# EAGLE schematic Arm-Claw Schematic (EAGLE 9.7.0)
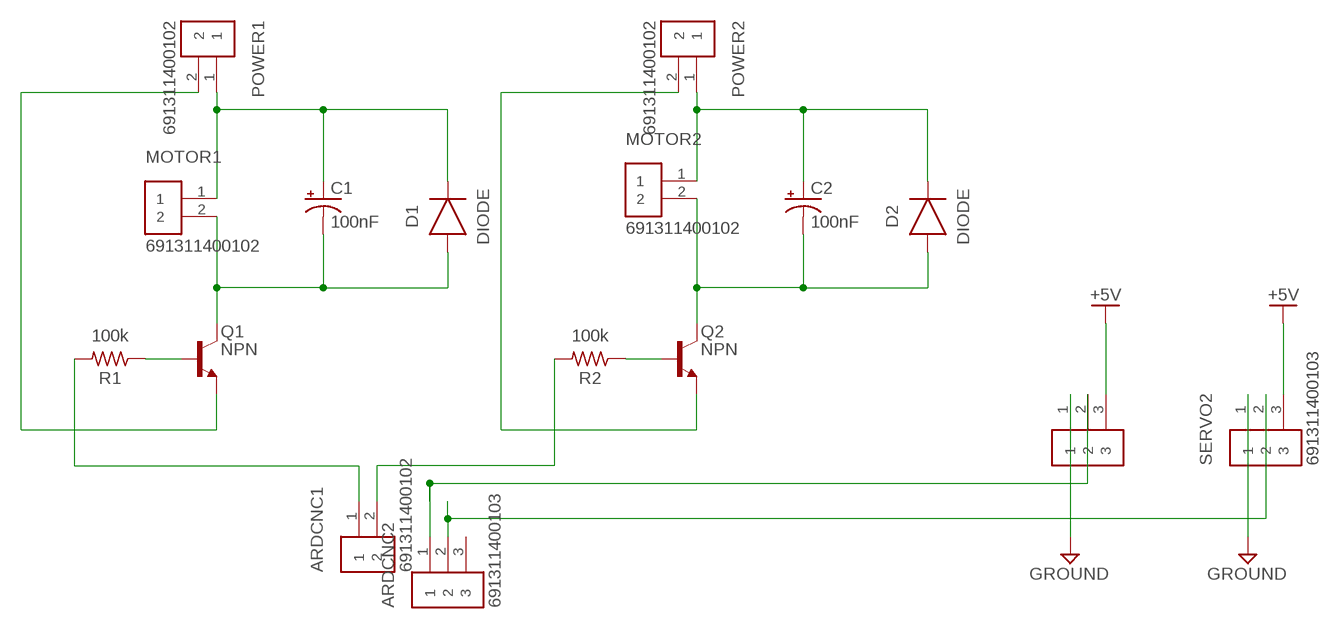
[diagram p0: schematic, sheet 1]

## Parts
ARDCNC1  691311400102  [TERMINALBLOCK_PLUGGABLE-2-7.62MM]
ARDCNC2  691311400103  [TERMINALBLOCK_PLUGGABLE-3-7.62MM]
C1  100nF  C-POL-US_AXIAL-34.1MM-PITCH  [CAPPAD3410W80L3025D1825B]
C2  100nF  C-POL-US_AXIAL-34.1MM-PITCH  [CAPPAD3410W80L3025D1825B]
D1  DIODE  DIODEDO-214AB(SMC)  [DIOM7959X625N]
D2  DIODE  DIODEDO-214AB(SMC)  [DIOM7959X625N]
MOTOR1  691311400102  [TERMINALBLOCK_PLUGGABLE-2-7.62MM]
MOTOR2  691311400102  [TERMINALBLOCK_PLUGGABLE-2-7.62MM]
POWER1  691311400102  [TERMINALBLOCK_PLUGGABLE-2-7.62MM]
POWER2  691311400102  [TERMINALBLOCK_PLUGGABLE-2-7.62MM]
Q1  NPN  NPN_TO18-EBC  [TO18]
Q2  NPN  NPN_TO18-EBC  [TO18]
R1  100k  R-US_AXIAL-7.2MM-PITCH  [RESAD724W46L381D178B]
R2  100k  R-US_AXIAL-7.2MM-PITCH  [RESAD724W46L381D178B]
SERVO1  691311400103  [TERMINALBLOCK_PLUGGABLE-3-7.62MM]
SERVO2  691311400103  [TERMINALBLOCK_PLUGGABLE-3-7.62MM]

## Nets
+5V: SERVO1.3 SERVO2.3
GROUND: SERVO1.1 SERVO2.1
MOTOR1: C1.1(+) D1.1(C) MOTOR1.1 POWER1.1
N$1: ARDCNC2.1 SERVO1.2
N$2: C1.2(-) D1.2(A) MOTOR1.2 Q1.3(C)
N$3: Q1.2(B) R1.1
N$5: ARDCNC1.1 R1.2
N$6: C2.1(+) D2.1(C) MOTOR2.1 POWER2.1
N$7: C2.2(-) D2.2(A) MOTOR2.2 Q2.3(C)
N$8: Q2.2(B) R2.1
N$9: POWER2.2 Q2.1(E)
N$10: ARDCNC1.2 R2.2
N$13: ARDCNC2.2 SERVO2.2
POWER1: POWER1.2 Q1.1(E)
Unconnected: ARDCNC2.3

## Library data of the parts
ARDCNC1 MOTOR1 MOTOR2 POWER1 POWER2 = Terminal Blocks:691311400102: 7.62MM CLOSE VERTICAL PCB HEADER WR-TBL Manufacturer's datasheet <https://katalog.we-online.com/em/datasheet/6913114001xx.pdf>; CREATED_BY: PCBLayout.com; DIGIKEY_PART_NO: 732-2823-ND; MANUFACTURER: WURTH ELEKTRONIK; MPN: 691311400102
ARDCNC2 SERVO1 SERVO2 = Terminal Blocks:691311400103: 7.62MM CLOSE VERTICAL PCB HEADER WR-TBL Manufacturer's datasheet <https://katalog.we-online.com/em/datasheet/6913114001xx.pdf>; CREATED_BY: PCBLayout.com; DIGIKEY_PART_NO: 732-2824-ND; MANUFACTURER: WURTH ELEKTRONIK; MPN: 691311400103
C1 C2 = Capacitor:C-POL-US: Capacitor Polarised - ANSI; CATEGORY: Capacitor
D1 D2 = Diode:DIODE: Diode Rectifier - Generic; CATEGORY: Diode; SUB-CATEGORY: Rectifier
Q1 Q2 = Transistor:NPN: NPN - Generic; CATEGORY: Transistor; SUB-CATEGORY: BJT; TYPE: NPN
R1 R2 = Resistor:R-US: Resistor Fixed - ANSI; CATEGORY: Resistor; SUB-CATEGORY: Fixed